# Altium project LeVentilateur.PrjPcb (part 4 of 4)

## Sheet 06-User Interface.SchDoc
size A4
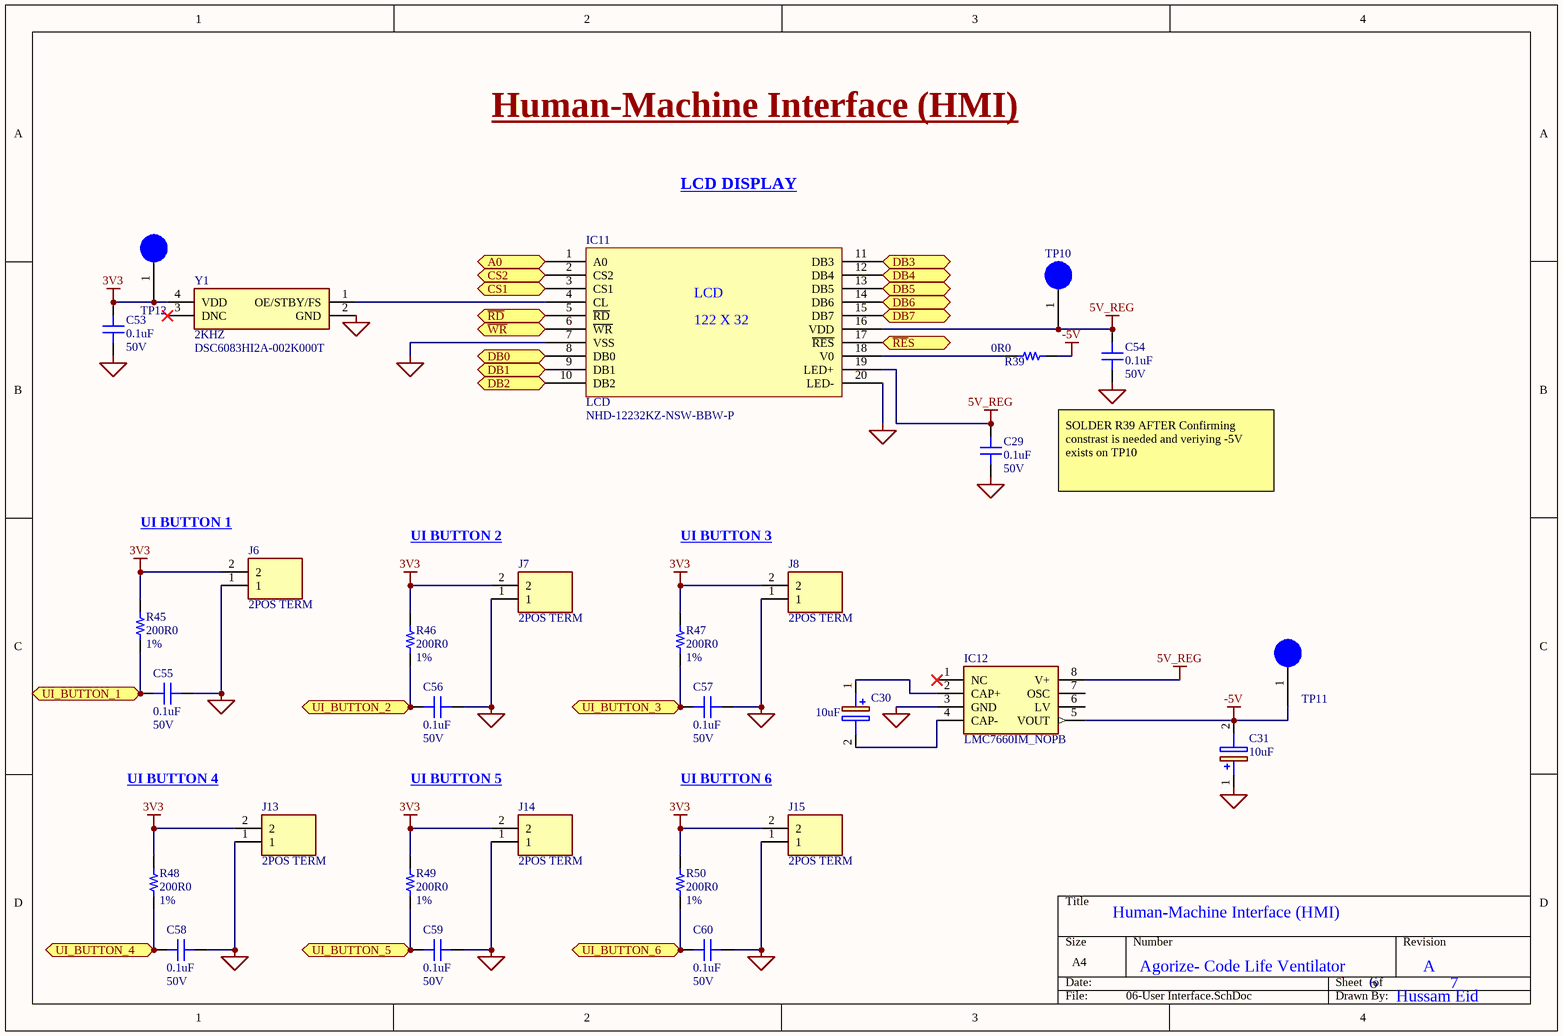
[diagram p6: 06-User Interface.SchDoc]

### Parts
C29  0.1uF  Voltage Rating: 50V  [CAP 0603/1608]
C30  10uF  [CAPAE430X580N]
C31  10uF  [CAPAE430X580N]
C53  0.1uF  Voltage Rating: 50V  [CAP 0603/1608]
C54  0.1uF  Voltage Rating: 50V  [CAP 0603/1608]
C55  0.1uF  Voltage Rating: 50V  [CAP 0603/1608]
C56  0.1uF  Voltage Rating: 50V  [CAP 0603/1608]
C57  0.1uF  Voltage Rating: 50V  [CAP 0603/1608]
C58  0.1uF  Voltage Rating: 50V  [CAP 0603/1608]
C59  0.1uF  Voltage Rating: 50V  [CAP 0603/1608]
C60  0.1uF  Voltage Rating: 50V  [CAP 0603/1608]
IC11  LCD  Manufacturer Part Number 1: NHD-12232KZ-NSW-BBW-P  [LCD_CONN]
IC12  LMC7660IM_NOPB  [SOIC127P600X175-8N]
J6  2POS TERM  [SHDR2W110P0X500_1X2_1000X830X1140P]
J7  2POS TERM  [SHDR2W110P0X500_1X2_1000X830X1140P]
J8  2POS TERM  [SHDR2W110P0X500_1X2_1000X830X1140P]
J13  2POS TERM  [SHDR2W110P0X500_1X2_1000X830X1140P]
J14  2POS TERM  [SHDR2W110P0X500_1X2_1000X830X1140P]
J15  2POS TERM  [SHDR2W110P0X500_1X2_1000X830X1140P]
R39  0R0  [RES 0603/1608]
R45  200R0  Tolerance: 1%  [RES 1206/3216]
R46  200R0  Tolerance: 1%  [RES 1206/3216]
R47  200R0  Tolerance: 1%  [RES 1206/3216]
R48  200R0  Tolerance: 1%  [RES 1206/3216]
R49  200R0  Tolerance: 1%  [RES 1206/3216]
R50  200R0  Tolerance: 1%  [RES 1206/3216]
TP10  TP  [TP]  (value not drawn)
TP11  TP  [TP]  (value not drawn)
TP12  TP  [TP]  (value not drawn)
Y1  2KHZ  Manufacturer Part Number 1: DSC6083HI2A-002K000T  [DSC6083HE1A032K800T]

### Ports
A0 (bidir), CS1 (bidir), CS2 (bidir), DB0 (bidir), DB1 (bidir), DB2 (bidir), DB3 (bidir), DB4 (bidir), DB5 (bidir), DB6 (bidir), DB7 (bidir), UI_BUTTON_1 (bidir), UI_BUTTON_2 (bidir), UI_BUTTON_3 (bidir), UI_BUTTON_4 (bidir), UI_BUTTON_5 (bidir), UI_BUTTON_6 (bidir), ~{RD} (bidir), ~{RE}S (bidir), ~{WR} (bidir)

### Nets
3V3: C53.1 J6.2 J7.2 J8.2 J13.2 J14.2 J15.2 R45.2 R46.2 R47.2 R48.2 R49.2 R50.2 TP12.1 Y1.4(VDD)
5V_REG: C29.1 C54.1 IC11.16(VDD) IC11.19(LED+) IC12.8(V+) TP10.1
-5V: C31.2(-) IC12.5(VOUT) R39.2 TP11.1
COM: C29.2 C31.1(+) C53.2 C54.2 C55.2 C56.2 C57.2 C58.2 C59.2 C60.2 IC11.7(VSS) IC11.20(LED-) IC12.3(GND) J6.1 J7.1 J8.1 J13.1 J14.1 J15.1 Y1.2(GND)
NetC30_1: C30.1(+) IC12.2(CAP+)
NetC30_2: C30.2(-) IC12.4(CAP-)
NetC55_1: C55.1 R45.1 ; port UI_BUTTON_1
NetC56_1: C56.1 R46.1 ; port UI_BUTTON_2
NetC57_1: C57.1 R47.1 ; port UI_BUTTON_3
NetC58_1: C58.1 R48.1 ; port UI_BUTTON_4
NetC59_1: C59.1 R49.1 ; port UI_BUTTON_5
NetC60_1: C60.1 R50.1 ; port UI_BUTTON_6
NetIC1_78: IC11.17(~{RES}) ; port ~{RE}S
NetIC1_79: IC11.6(~{WR}) ; port ~{WR}
NetIC1_80: IC11.5(~{RD}) ; port ~{RD}
NetIC1_81: IC11.15(DB7) ; port DB7
NetIC1_82: IC11.14(DB6) ; port DB6
NetIC1_83: IC11.13(DB5) ; port DB5
NetIC1_84: IC11.12(DB4) ; port DB4
NetIC1_85: IC11.11(DB3) ; port DB3
NetIC1_86: IC11.10(DB2) ; port DB2
NetIC1_87: IC11.9(DB1) ; port DB1
NetIC1_88: IC11.8(DB0) ; port DB0
NetIC1_91: IC11.3(CS1) ; port CS1
NetIC1_92: IC11.2(CS2) ; port CS2
NetIC1_93: IC11.1(A0) ; port A0
NetIC11_4: IC11.4(CL) Y1.1(OE/STBY/FS)
NetIC11_18: IC11.18(V0) R39.1

Not connected (* = marked no-connect by the designer): IC12 1(NC)* 6(LV) 7(OSC); Y1 3(DNC)*

### Notes on the sheet
- Human-Machine Interface (HMI)
- LCD DISPLAY
- SOLDER R39 AFTER Confirming constrast is needed and veriying -5V exists on TP10
- (near J6) UI BUTTON 1
- (near J7) UI BUTTON 2
- (near J8) UI BUTTON 3
- UI BUTTON 4
- UI BUTTON 5
- UI BUTTON 6
- Agorize- Code Life Ventilator
- 6
- A
- 7
- Hussam Eid
- (in symbol Component_1) 122 X 32

### Library data of the parts
C29 C53-C60 = C1608X7R1E104K080AA: CAP CER 0.1UF 50V X7R 0603; Manufacturer 1: KEMET; Manufacturer Part Number 1: C0603C104M5RACTU; Description 1: Cap Ceramic 0.1uF 50V X7R 20% SMD 0603 125C T/R; Dielectric Material: Ceramic; Capacitance: 100nF; Tolerance: 20%; Dissipation Factor: 2.5%; ComponentLink1Description: Datasheet; ComponentLink1URL: https://product.tdk.com/info/en/catalog/datasheets/mlcc_commercial_general_en.pdf; ComponentLink2Description: Digi-Key listing; ComponentLink2URL: http://digikey.com/product-detail/en/C1608X7R1E104K080AA/445-1316-1-ND/567697; Supplier 1: Digi-Key; Supplier Part Number 1: 399-7845-1-ND; RoHS 1: Yes; Stock 1: 3475152; Pricing 1: 1 = 0.10000, 10 = 0.03900, 100 = 0.01740, 500 = 0.01240, 1000 = 0.00974 (USD); Mount: Surface Mount,PCB; Case/Package: 0603; Contact Plating: Tin,Matte; Case Code (Metric): 1608; Case Code (Imperial): 0603; Min Operating Temperature: -55°C; Max Operating Temperature: 125°C; Dielectric: X7R; Termination: SMD/SMT; Package Quantity: 1; Packaging: Tape and Reel; Voltage Rating (DC): 50V; Length: 1.6mm; Height: 0.8mm; Thickness: 0.034inch; Lead Pitch: 0.7mm; Depth: 0.8mm; Width: 0.031inch; Radiation Hardening: No; REACH SVHC: No SVHC; ComponentLink3URL: https://www.verical.com/server-webapp/html/getDatasheet?partID=626892&src-supplier=Verical; ComponentLink3Description: https://www.verical.com/server-webapp/html/getDatasheet?partID=626892&src-supplier=Verical; ComponentLink4URL: http://www.farnell.com/datasheets/2746056.pdf?src-supplier=Farnell; ComponentLink4Description: http://www.farnell.com/datasheets/2746056.pdf?src-supplier=Farnell; ComponentLink5URL: http://components.arrow.com/part/dataview/0323_00313986?src-supplier=Arrow+Europe; ComponentLink5Description: http://components.arrow.com/part/dataview/0323_00313986?src-supplier=Arrow+Europe; ComponentLink6URL: http://www.mouser.com/ds/2/212/KEM_C1002_X7R_SMD-1102033.pdf?src-supplier=Mouser; ComponentLink6Description: http://www.mouser.com/ds/2/212/KEM_C1002_X7R_SMD-1102033.pdf?src-supplier=Mouser; ComponentLink7URL: http://www.alliedelec.com/m/d/6f3b5eb83d09db50ed28bdc730567b33.pdf?src-supplier=Allied+Electronics; ComponentLink7Description: http://www.alliedelec.com/m/d/6f3b5eb83d09db50ed28bdc730567b33.pdf?src-supplier=Allied+Electronics; ComponentLink8URL: http://components.arrow.com/part/dataview/40911037S8853915N7429?src-supplier=Arrow; ComponentLink8Description: http://components.arrow.com/part/dataview/40911037S8853915N7429?src-supplier=Arrow; ComponentLink9URL: http://www.farnell.com/datasheets/2746056.pdf?src-supplier=Newark; ComponentLink9Description: http://www.farnell.com/datasheets/2746056.pdf?src-supplier=Newark; ComponentLink10URL: http://www.farnell.com/datasheets/1828800.pdf?src-supplier=Newark; ComponentLink10Description: http://www.farnell.com/datasheets/1828800.pdf?src-supplier=Newark; ComponentLink11URL: http://capacitoredge.kemet.com/capedge2/DataSheet?pn=C0603C104M5RAC7867&src-supplier=Avnet+Asia; ComponentLink11Description: http://capacitoredge.kemet.com/capedge2/DataSheet?pn=C0603C104M5RAC7867&src-supplier=Avnet+Asia; ComponentLink12URL: https://api.kemet.com/component-edge/download/datasheet/C0603C104M5RACTU.pdf?src-supplier=Digi-Key; ComponentLink12Description: https://api.kemet.com/component-edge/download/datasheet/C0603C104M5RACTU.pdf?src-supplier=Digi-Key; ComponentLink13URL: https://www.verical.com/server-webapp/html/getDatasheet?partID=110138&src-supplier=Verical; ComponentLink13Description: https://www.verical.com/server-webapp/html/getDatasheet?partID=110138&src-supplier=Verical; ComponentLink14URL: http://capacitoredge.kemet.com/capedge2/DataSheet?pn=C0603C104M5RAC7867&src-supplier=Avnet; ComponentLink14Description: http://capacitoredge.kemet.com/capedge2/DataSheet?pn=C0603C104M5RAC7867&src-supplier=Avnet; ComponentLink15URL: http://www.farnell.com/datasheets/2315113.pdf?src-supplier=Newark; ComponentLink15Description: http://www.farnell.com/datasheets/2315113.pdf?src-supplier=Newark; ComponentLink16URL: http://www.farnell.com/datasheets/2746056.pdf?src-supplier=Element14; ComponentLink16Description: http://www.farnell.com/datasheets/2746056.pdf?src-supplier=Element14
C30 C31 = CS1A470M-CRC54: Capacitor Polarised; Manufacturer_Name: SEMTECH; Manufacturer Part Number 1: CS1V100M-CRC54; Manufacturer 1: LCS-ST(Semtech); Datasheet Link: https://datasheet.lcsc.com/szlcsc/1811061120_ST-Semtech-CS1V100M-CRC54_C117835.pdf; Height: 5.8mm
IC11 = Component_1: LCD MOD GRAPH 122X32 WH TRANSM; Manufacturer 1: Newhaven Display; Description 1: 122 by 32 Character LCD Display Module 5 Volts White Letters; Interface: Parallel,8 bit; Background Color: Blue; Resolution (height): 32pixel; Resolution (width): 122pixel; Backlight Type: LED; Supplier 1: Digi-Key; Supplier Part Number 1: NHD-12232KZ-NSW-BBW-P-ND; RoHS 1: Yes; Stock 1: 610; Pricing 1: 1 = 13.85000, 5 = 13.01800, 10 = 12.18700, 50 = 11.60400 (USD); Case/Package: Module; Min Operating Temperature: -20°C; Max Operating Temperature: 70°C; Packaging: Bulk; Package Quantity: 50; ComponentLink1URL: https://datasheet.ciiva.com/19454/2154919-19454139.pdf?src-supplier=Jameco; ComponentLink1Description: https://datasheet.ciiva.com/19454/2154919-19454139.pdf?src-supplier=Jameco; ComponentLink2URL: https://datasheet.ciiva.com/5326/nhd-12232kz-nsw-bbw-p-44813-5326535.pdf?src-supplier=Mouser; ComponentLink2Description: https://datasheet.ciiva.com/5326/nhd-12232kz-nsw-bbw-p-44813-5326535.pdf?src-supplier=Mouser; ComponentLink3URL: https://datasheet.ciiva.com/2103/nhd-12232kz-nsw-bbw-p-2103129.pdf?src-supplier=Digi-Key; ComponentLink3Description: https://datasheet.ciiva.com/2103/nhd-12232kz-nsw-bbw-p-2103129.pdf?src-supplier=Digi-Key; ComponentLink4URL: https://datasheet.ciiva.com/49271/70518174-49271942.pdf?src-supplier=Allied+Electronics; ComponentLink4Description: https://datasheet.ciiva.com/49271/70518174-49271942.pdf?src-supplier=Allied+Electronics
IC12 = LMC7660IM_NOPB: IC REG CHARGE PUMP INV 8SOIC; Manufacturer_Name: Texas Instruments; Manufacturer Part Number 1: LMC7660IM/NOPB; Datasheet Link: http://www.ti.com/lit/ds/symlink/lmc7660.pdf; Height: 1.75mm; Mouser Part Number: 926-LMC7660IM/NOPB; Mouser Price/Stock: https://www.mouser.com/Search/Refine.aspx?Keyword=926-LMC7660IM%2FNOPB; RS Part Number: 5360212P; RS Price/Stock: http://uk.rs-online.com/web/p/products/5360212P; Manufacturer 1: Texas Instruments
J6-J8 J13-J15 = 1935161: TERM BLK 2POS SIDE ENTRY 5MM PCB; Manufacturer 1: Phoenix Contact; Description 1: Conn Terminal Blocks 2 POS 5mm Solder ST Thru-Hole 16A; Connector Type: Screw; Voltage Rating (DC): 320V; Max Current Rating: 16A; Max Supply Voltage: 250V; Current Rating: 17.5A; Number of Poles: 2; Number of Levels: 1; Current: 18A; Voltage: 300V; Wire Gauge (Max): 26AWG; Wire Gauge (Min): 12AWG; Approvals: UL; ComponentLink1URL: https://datasheet.ciiva.com/15169/getdatasheetpartid-177903-15169663.pdf?src-supplier=Verical; ComponentLink1Description: https://datasheet.ciiva.com/15169/getdatasheetpartid-177903-15169663.pdf?src-supplier=Verical; ComponentLink2URL: https://datasheet.ciiva.com/16047/1935161-16047247.pdf?src-supplier=Onlinecomponents.com; ComponentLink2Description: https://datasheet.ciiva.com/16047/1935161-16047247.pdf?src-supplier=Onlinecomponents.com; ComponentLink3URL: https://datasheet.ciiva.com/824/combiconcompact5-0mmseries-824222.pdf?src-supplier=Digi-Key; ComponentLink3Description: https://datasheet.ciiva.com/824/combiconcompact5-0mmseries-824222.pdf?src-supplier=Digi-Key; Supplier 1: Digi-Key; Supplier Part Number 1: 277-1667-ND; Manufacturer Part Number 1: 1935161; RoHS 1: Yes; Stock 1: 32563; Pricing 1: 1 = 0.43000, 10 = 0.41100, 50 = 0.39280, 100 = 0.38200, 250 = 0.35700, 500 = 0.32844, 1000 = 0.30350 (USD); Mount: Through Hole; Number of Pins: 2; Weight: 0.067021oz; Contact Material: Copper,Tin; Insulation Material: Nylon; Housing Material: Polyamide; Housing Color: Green; Color: Green; Material: Nylon; Number of Rows: 1; Voltage Rating: 250V; Package Quantity: 250; Packaging: Bulk; Number of Positions: 2; Number of Positions Per Level: 2; Termination: Solder; Number of Contacts: 2; Number of Circuits: 2; Orientation: Straight; Length: 9mm; Height: 11.3mm; Width: 14.9mm; Pitch: 5mm; Depth: 9mm; Wire/Cable Gauge: 26AWG; Radiation Hardening: No; Flammability Rating: UL94 V-0; Lead Free: Lead Free; REACH SVHC: Unknown
R39 = ERJ-3EKF1001V: RES SMD 0 OHM JUMPER 1/10W 0603; Manufacturer 1: Panasonic; Manufacturer Part Number 1: ERJ-3GEY0R00V; Description 1: Res Thick Film 0603 0 Ohm Jumper Molded SMD Punched Carrier T/R; Resistance: 0mR; Power Rating: 100mW; Voltage Rating: 75V; Tolerance: 0%; Voltage Rating (DC): 50V; Temperature Coefficient: 600ppm/°C; ComponentLink1Description: Datasheet; ComponentLink1URL: http://industrial.panasonic.com/www-cgi/jvcr13pz.cgi?E+PZ+3+AOA0002+ERJ3EKF1001V+7+WW; ComponentLink2Description: Digi-Key listing; ComponentLink2URL: http://digikey.com/product-detail/en/ERJ-3EKF1001V/P1.00KHTR-ND/196032; Supplier 1: Digi-Key; Supplier Part Number 1: P0.0GDKR-ND; RoHS 1: Yes; Stock 1: 17444338; Pricing 1: 1 = 0.10000, 10 = 0.03800, 25 = 0.02760, 50 = 0.02120, 100 = 0.01560, 250 = 0.01188, 500 = 0.00950, 1000 = 0.00700 (USD); Mount: Surface Mount; Case/Package: 0603; Contact Plating: Tin; Case Code (Metric): 1608; Case Code (Imperial): 0603; Min Operating Temperature: -55°C; Max Operating Temperature: 155°C; Composition: Thick Film; Packaging: Tape and Reel; Package Quantity: 1; Number of Terminations: 2; Termination: SMD/SMT; Military Standard: Not; Features: Automotive AEC-Q200; Max Power Dissipation: 100mW; Length: 1.6mm; Height: 0.45mm; Width: 0.031inch; Depth: 0.8mm; Radiation Hardening: No; Lead Free: Lead Free; REACH SVHC: No SVHC; ComponentLink3URL: https://datasheet.ciiva.com/27055/1935748-27055113.pdf?src-supplier=Jameco; ComponentLink3Description: https://datasheet.ciiva.com/27055/1935748-27055113.pdf?src-supplier=Jameco; ComponentLink4URL: https://datasheet.ciiva.com/11808/0900766b80f806dd-11808207.pdf?src-supplier=RSComponents; ComponentLink4Description: https://datasheet.ciiva.com/11808/0900766b80f806dd-11808207.pdf?src-supplier=RSComponents; ComponentLink5URL: https://datasheet.ciiva.com/48532/aoa0000ce1-48532165.pdf?src-supplier=Avnet; ComponentLink5Description: https://datasheet.ciiva.com/48532/aoa0000ce1-48532165.pdf?src-supplier=Avnet; ComponentLink6URL: https://datasheet.ciiva.com/43460/1678796-43460647.pdf?src-supplier=Farnell; ComponentLink6Description: https://datasheet.ciiva.com/43460/1678796-43460647.pdf?src-supplier=Farnell; ComponentLink7URL: https://datasheet.ciiva.com/28695/1678796-28695833.pdf?src-supplier=Element14; ComponentLink7Description: https://datasheet.ciiva.com/28695/1678796-28695833.pdf?src-supplier=Element14; ComponentLink8URL: https://datasheet.ciiva.com/5959/1678796-5959707.pdf?src-supplier=Farnell; ComponentLink8Description: https://datasheet.ciiva.com/5959/1678796-5959707.pdf?src-supplier=Farnell; ComponentLink9URL: https://datasheet.ciiva.com/46377/1678796-46377868.pdf?src-supplier=Element14; ComponentLink9Description: https://datasheet.ciiva.com/46377/1678796-46377868.pdf?src-supplier=Element14; ComponentLink10URL: https://datasheet.ciiva.com/9198/aoa0000ce1-9198975.pdf?src-supplier=Avnet; ComponentLink10Description: https://datasheet.ciiva.com/9198/aoa0000ce1-9198975.pdf?src-supplier=Avnet; ComponentLink11URL: https://datasheet.ciiva.com/16758/70255313-16758527.pdf?src-supplier=Allied+Electronics; ComponentLink11Description: https://datasheet.ciiva.com/16758/70255313-16758527.pdf?src-supplier=Allied+Electronics; ComponentLink12URL: https://datasheet.ciiva.com/16834/aoa0000ce1-16834828.pdf?src-supplier=Future+Electronics; ComponentLink12Description: https://datasheet.ciiva.com/16834/aoa0000ce1-16834828.pdf?src-supplier=Future+Electronics; ComponentLink13URL: https://datasheet.ciiva.com/17215/aoa0000ce1-17215388.pdf?src-supplier=Avnet+Europe; ComponentLink13Description: https://datasheet.ciiva.com/17215/aoa0000ce1-17215388.pdf?src-supplier=Avnet+Europe; ComponentLink14URL: https://datasheet.ciiva.com/30199/4aoa0000ce1-30199822.pdf?src-supplier=Onlinecomponents.com; ComponentLink14Description: https://datasheet.ciiva.com/30199/4aoa0000ce1-30199822.pdf?src-supplier=Onlinecomponents.com
R45-R50 = ERJ-8ENF1002V: RES SMD 10K OHM 1% 1/4W 1206; Manufacturer 1: Yageo; Manufacturer Part Number 1: RC1206FR-07200RL; Description 1: Res Thick Film 1206 200 Ohm 1% 0.25W(1/4W) ±100ppm/C Molded SMD Paper T/R; Temperature Coefficient: 100ppm/°C; Resistance: 200R; Voltage Rating (DC): 200V; Power Rating: 250mW; ComponentLink1Description: Datasheet; ComponentLink1URL: http://industrial.panasonic.com/www-cgi/jvcr13pz.cgi?E+PZ+3+AOA0002+ERJ8ENF1002V+7+WW; ComponentLink2Description: Digi-Key listing; ComponentLink2URL: http://digikey.com/product-detail/en/ERJ-8ENF1002V/P10.0KFTR-ND/89059; Supplier 1: Digi-Key; Supplier Part Number 1: 311-200FRCT-ND; RoHS 1: Yes; Stock 1: 2870115; Pricing 1: 1 = 0.10000, 10 = 0.07100, 100 = 0.02910, 1000 = 0.01306, 2500 = 0.01134 (USD); Mount: Surface Mount; Case/Package: 1206; Weight: 0.000571oz; Case Code (Metric): 3216; Case Code (Imperial): 1206; Min Operating Temperature: -55°C; Max Operating Temperature: 155°C; Composition: Thick Film; Packaging: Tape and Reel; Termination: SMD/SMT; Military Standard: Not; Voltage Rating: 200V; Length: 3.1mm; Height: 0.55mm; Width: 1.6mm; Depth: 1.6mm; Lead Free: Lead Free; ComponentLink3URL: https://datasheet.ciiva.com/11808/0900766b80c6630a-11808603.pdf?src-supplier=RSComponents; ComponentLink3Description: https://datasheet.ciiva.com/11808/0900766b80c6630a-11808603.pdf?src-supplier=RSComponents
TP10-TP12 = TP: Test Point; Manufacturer 1: N/A
Y1 = DSC6083HE1A-032K800T: MEMS OSC XO 2.0000KHZ CMOS SMD; Manufacturer 1: Microchip; Supplier 1: Digi-Key; Supplier Part Number 1: DSC6083HI2A-002K000TCT-ND; RoHS 1: No; Description 1: MEMS OSC XO 2.0000KHZ CMOS SMD; Stock 1: 822; Pricing 1: 1 = 1.17000, 25 = 0.97000, 100 = 0.88000 (USD); ComponentLink1URL: http://www.microchip.com/mymicrochip/filehandler.aspx?ddocname=en587489&src-supplier=Digi-Key; ComponentLink1Description: http://www.microchip.com/mymicrochip/filehandler.aspx?ddocname=en587489&src-supplier=Digi-Key

## Sheet 07-Mechanicals.SchDoc
size A4; DrawnBy: Hussam E; Engineer: Hussam E; SheetNumber: 1
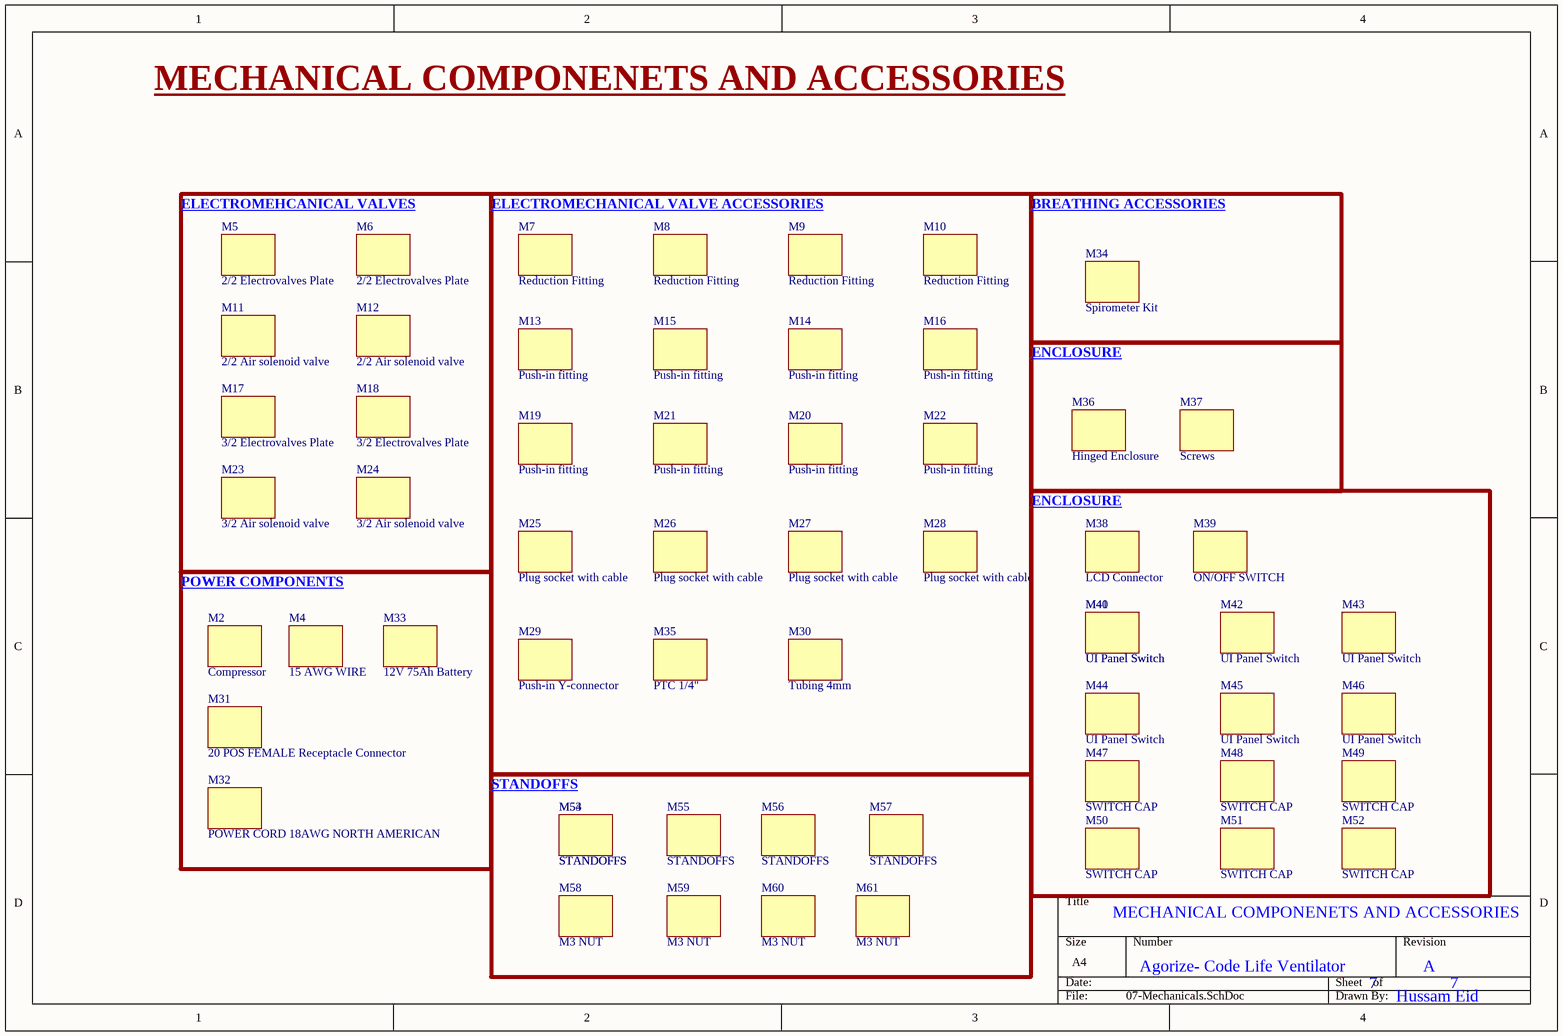
[diagram p7: 07-Mechanicals.SchDoc]

### Parts
M2  Compressor  (mechanical)
M4  15 AWG WIRE  (mechanical)
M5  2/2 Electrovalves Plate  (mechanical)
M6  2/2 Electrovalves Plate  (mechanical)
M7  Reduction Fitting  (mechanical)
M8  Reduction Fitting  (mechanical)
M9  Reduction Fitting  (mechanical)
M10  Reduction Fitting  (mechanical)
M11  2/2 Air solenoid valve  (mechanical)
M12  2/2 Air solenoid valve  (mechanical)
M13  Push-in fitting  (mechanical)
M14  Push-in fitting  (mechanical)
M15  Push-in fitting  (mechanical)
M16  Push-in fitting  (mechanical)
M17  3/2 Electrovalves Plate  (mechanical)
M18  3/2 Electrovalves Plate  (mechanical)
M19  Push-in fitting  (mechanical)
M20  Push-in fitting  (mechanical)
M21  Push-in fitting  (mechanical)
M22  Push-in fitting  (mechanical)
M23  3/2 Air solenoid valve  (mechanical)
M24  3/2 Air solenoid valve  (mechanical)
M25  Plug socket with cable  (mechanical)
M26  Plug socket with cable  (mechanical)
M27  Plug socket with cable  (mechanical)
M28  Plug socket with cable  (mechanical)
M29  Push-in Y-connector  (mechanical)
M30  Tubing 4mm  (mechanical)
M31  20 POS FEMALE Receptacle Connector  (mechanical)
M32  POWER CORD 18AWG NORTH AMERICAN  (mechanical)
M33  12V 75Ah Battery  (mechanical)
M34  Spirometer Kit  (mechanical)
M35  PTC 1/4"  (mechanical)
M36  Hinged Enclosure  (mechanical)
M37  Screws  (mechanical)
M38  LCD Connector  (mechanical)
M39  ON/OFF SWITCH  (mechanical)
M40  UI Panel Switch  (mechanical)
M41  UI Panel Switch  (mechanical)
M42  UI Panel Switch  (mechanical)
M43  UI Panel Switch  (mechanical)
M44  UI Panel Switch  (mechanical)
M45  UI Panel Switch  (mechanical)
M46  UI Panel Switch  (mechanical)
M47  SWITCH CAP  (mechanical)
M48  SWITCH CAP  (mechanical)
M49  SWITCH CAP  (mechanical)
M50  SWITCH CAP  (mechanical)
M51  SWITCH CAP  (mechanical)
M52  SWITCH CAP  (mechanical)
M53  STANDOFFS  (mechanical)
M54  STANDOFFS  (mechanical)
M55  STANDOFFS  (mechanical)
M56  STANDOFFS  (mechanical)
M57  STANDOFFS  (mechanical)
M58  M3 NUT  (mechanical)
M59  M3 NUT  (mechanical)
M60  M3 NUT  (mechanical)
M61  M3 NUT  (mechanical)

### Notes on the sheet
- MECHANICAL COMPONENETS AND ACCESSORIES
- (near M34) BREATHING ACCESSORIES
- ENCLOSURE
- ELECTROMEHCANICAL VALVES
- ELECTROMECHANICAL VALVE ACCESSORIES
- POWER COMPONENTS
- STANDOFFS
- Agorize- Code Life Ventilator
- 7
- A
- Hussam Eid

### Library data of the parts
M2 = Compressor: 15A 60PSI Compressor; Manufacturer 1: McMaster; Manufacturer Part Number 1: 4251K71; Parameter 1: *
M4 = Compressor: HOOK-UP DUAL STRND 20AWG WHT 5'; Manufacturer Part Number 1: 20 AWG WIRE; Manufacturer 1: 81044/12-20-9
M5 M6 = Compressor: Manufacturer_Part_Number: MHP1-AS-2-M3; Manufacturer: Festo; Manufacturer Part Number 1: MHP1-AS-2-M3; Manufacturer 1: Festo
M7-M10 = Compressor: Push-in fitting 1/4mm to 4mm; Manufacturer_Part_Number: QS-1/4-4; Manufacturer_Part_Number_1: 190644; Manufacturer: Festo; Manufacturer Part Number 1: QS-1/4-4; Manufacturer 1: Festo
M11 M12 = Compressor: Manufacturer_Part_Number: MHP1-M4H-2/2G-M3-TC; Manufacturer_Part_Number_1: 197048; Manufacturer: Festo; Manufacturer Part Number 1: MHP1-M4H-2/2G-M3-TC; Manufacturer 1: Festo
M13-M16 M19-M22 = Compressor: Manufacturer_Part_Number: QSM-M3-4-I; Manufacturer_Part_Number_1: 153314; Manufacturer: Festo; Manufacturer Part Number 1: QSM-M3-4-I; Manufacturer 1: Festo
M17 M18 = Compressor: 2/2 Electrovalves Plate; Manufacturer_Part_Number: MHP1-AS-3-M3; Manufacturer: Festo; Manufacturer Part Number 1: MHP1-AS-3-M3; Manufacturer 1: Festo
M23 M24 = Compressor: 2/2 Air solenoid valve; Manufacturer_Part_Number: MHP1-M4H-3/2GM3-TC; Manufacturer_Part_Number_1: 197048; Manufacturer: Festo; Manufacturer Part Number 1: MHP1-M4H-3/2GM3-TC; Manufacturer 1: Festo
M25-M28 = Compressor: Plug socket with cable for Valves; Manufacturer_Part_Number: KMH-0,5; Manufacturer_Part_Number_1: 197263; Manufacturer: Festo; Manufacturer Part Number 1: KMH-0,5; Manufacturer 1: Festo
M29 = Compressor: Manufacturer_Part_Number: QSY-8-4; Manufacturer_Part_Number_1: 130610; Manufacturer: Festo; Manufacturer Part Number 1: QSY-8-4; Manufacturer 1: Festo
M30 = Compressor: 4mm Plastic Tubing; Manufacturer_Part_Number: PUN-H-4X0,75-BL; Manufacturer_Part_Number_1: 197383; Manufacturer 1: Festo; Manufacturer Part Number 1: PUN-H-4X0,75-BL
M31 = Compressor: CONN RCPT 20POS 0.05 GOLD PCB; Manufacturer Part Number 1: 20021311-00020T4LF; Manufacturer 1: Amphenol ICC (FCI)
M32 = Compressor: CORD 18AWG 5-15P - 320-C13 9.84'; Manufacturer Part Number 1: A-PC2302-030021-1; Manufacturer 1: Assmann WSW Components
M33 = Compressor: Battery 12V 75Ah; Manufacturer 1: Powersonic; Manufacturer Part Number 1: PS-12750S
M34 = Compressor: 22mm Compact, extendable breathing system with luer elbow, 1.5m; Manufacturer_Part_Number: 2150000; Manufacturer 1: Intersurgical; Manufacturer Part Number 1: 2150000
M35 = Compressor: Vixen Air Inflation Schrader Valve with Push to Connect (PTC) for 1/4" OD Air Line; Manufacturer_Part_Number: VXA1014-2; Manufacturer 1: Vixen Air Inflation; Manufacturer Part Number 1: VXA1014-2
M36 = Compressor: WQ-64 NEMA Hinged Enclosure / 14.96 x 11.02 x 5.12 in; Manufacturer 1: PolyCase; Manufacturer Part Number 1: WQ-64
M37 = Compressor: PCB Screws for WH/WQ Series Enclosures / 0.43 x 0.31 x 0.31 in; Manufacturer 1: PolyCase; Manufacturer Part Number 1: SCREWS-007-50
M38 = Compressor: CONN HDR 20POS 0.05 GOLD SMD; Manufacturer 1: Sullins Connector Solutions; Manufacturer Part Number 1: SFH31-NPPB-D10-SP-BK
M39 = Compressor: SWITCH SPST On-Off 16A (AC); Manufacturer 1: HONGJU; Manufacturer Part Number 1: R-1-110-C5N-BB
M40-M46 = Compressor: SWITCH SPST 10mA Panel Mounting; Manufacturer 1: Kailh; Manufacturer Part Number 1: CPG151101S13
M47-M52 = Compressor: Switch accessories - Caps RoHS; Manufacturer 1: E-Switch; Manufacturer Part Number 1: 6JBLK
M53-M57 = Compressor: M3*30 Studs RoHS; Manufacturer 1: LCS; Manufacturer Part Number 1: C89822
M58-M61 = Compressor: Manufacturer 1: LCS; Manufacturer Part Number 1: C357432

## Nets that join several sheets
3V3: 01-Power (7 pins), 02-MCU (5 pins), 05-Alarm (R14.2), 06-User Interface (15 pins)
5V_REG: 01-Power (C28.1 PS2.3), 03-Actuators (J9.1 J10.1 J11.1 J12.1), 04-Sensors (C45.1 IC6.3), 06-User Interface (6 pins)
12V_REG: 01-Power (C39.1 D6.2 IC4.1 TP6.1), 04-Sensors (10 pins)
COM: 01-Power (23 pins), 02-MCU (31 pins), 03-Actuators (6 pins), 04-Sensors (21 pins), 05-Alarm (LED4.2 R17.2), 06-User Interface (20 pins)
COM_ISO: 01-Power (C28.2 PS2.5 R27.2), 03-Actuators (IC3.9 IC3.11 IC3.13 IC3.15)
VDD_MCU: 01-Power (R5.2), 02-MCU (25 pins)
Vin: 01-Power (11 pins), 03-Actuators (D5.1 RE2.2 RE2.3), 05-Alarm (B1.1 R13.2)
NetC55_1: 02-MCU (IC1.66), 06-User Interface (C55.1 R45.1)
NetC56_1: 02-MCU (IC1.67), 06-User Interface (C56.1 R46.1)
NetC57_1: 02-MCU (IC1.68), 06-User Interface (C57.1 R47.1)
NetC58_1: 02-MCU (IC1.69), 06-User Interface (C58.1 R48.1)
NetC59_1: 02-MCU (IC1.70), 06-User Interface (C59.1 R49.1)
NetC60_1: 02-MCU (IC1.71), 06-User Interface (C60.1 R50.1)
NetIC1_29: 02-MCU (IC1.29), 04-Sensors (R33.1)
NetIC1_30: 02-MCU (IC1.30), 04-Sensors (R36.1)
NetIC1_32: 02-MCU (IC1.32), 04-Sensors (R29.1)
NetIC1_53: 02-MCU (IC1.53), 05-Alarm (R15.2)
NetIC1_54: 02-MCU (IC1.54), 05-Alarm (R16.2)
NetIC1_55: 02-MCU (IC1.55), 03-Actuators (U1.1)
NetIC1_56: 02-MCU (IC1.56), 03-Actuators (R25.1)
NetIC1_57: 02-MCU (IC1.57), 03-Actuators (R23.1)
NetIC1_58: 02-MCU (IC1.58), 03-Actuators (R21.1)
NetIC1_59: 02-MCU (IC1.59), 03-Actuators (R19.1)
NetIC1_78: 02-MCU (IC1.78), 06-User Interface (IC11.17)
NetIC1_79: 02-MCU (IC1.79), 06-User Interface (IC11.6)
NetIC1_80: 02-MCU (IC1.80), 06-User Interface (IC11.5)
NetIC1_81: 02-MCU (IC1.81), 06-User Interface (IC11.15)
NetIC1_82: 02-MCU (IC1.82), 06-User Interface (IC11.14)
NetIC1_83: 02-MCU (IC1.83), 06-User Interface (IC11.13)
NetIC1_84: 02-MCU (IC1.84), 06-User Interface (IC11.12)
NetIC1_85: 02-MCU (IC1.85), 06-User Interface (IC11.11)
NetIC1_86: 02-MCU (IC1.86), 06-User Interface (IC11.10)
NetIC1_87: 02-MCU (IC1.87), 06-User Interface (IC11.9)
NetIC1_88: 02-MCU (IC1.88), 06-User Interface (IC11.8)
NetIC1_91: 02-MCU (IC1.91), 06-User Interface (IC11.3)
NetIC1_92: 02-MCU (IC1.92), 06-User Interface (IC11.2)
NetIC1_93: 02-MCU (IC1.93), 06-User Interface (IC11.1)

## Assembly variants
LeVentilateur-Proto: not fitted D3 D5 D6 R2 R8 R9 R10 R13 R26 R27 R29 R33 R36 R39